# Altium schematic sheet Relay.SchDoc
size A4; Organization: Altium Limited; Address1: L3, 12a Rodborough Rd; Address2: Frenchs Forest; Address3: NSW; Address4: Australia 2086
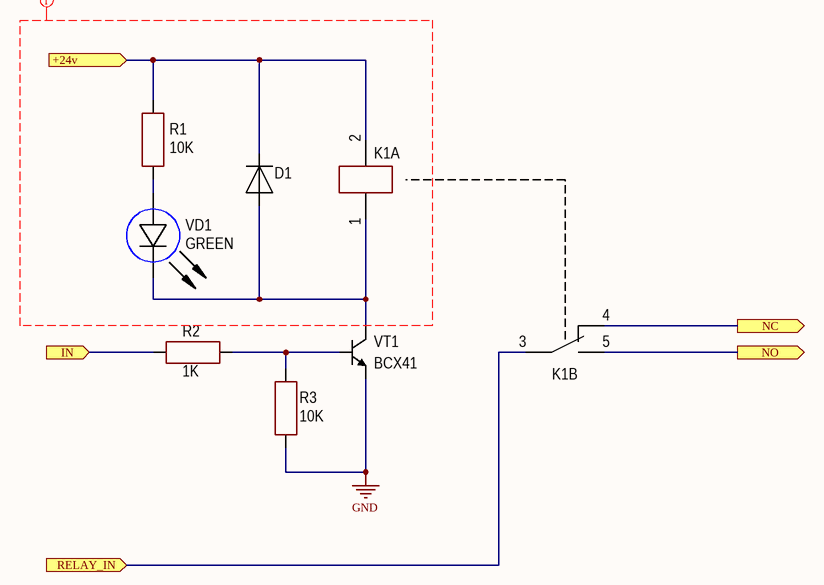
[diagram p0: Relay.SchDoc]

## Parts
D1  (no value)  [DIODE: SMA]
K1  (no value)  [REL: TRJ]  (parts A,B of 2)
R1  value 10K  [RES: 1206]
R2  value 1K  [RES: 1206]
R3  value 10K  [RES: 1206]
VD1  Color: GREEN  [LED: 1206G]
VT1  PartNumber: BCX41  [SOT23]

## Ports
+24v (in), IN (in), NC (out), NO (out), RELAY_IN (in)

## Nets
GND: R3.2 VT1.2(E)
+24v: D1.2 K1.2 R1.1 ; port +24v
IN: R2.1 ; port IN
NC: K1.4 ; port NC
NO: K1.5 ; port NO
RELAY_IN: K1.3 ; port RELAY_IN
NetD1_1: D1.1 K1.1 VD1.2(C) VT1.3(C)
NetR1_2: R1.2 VD1.1(A)
NetR2_2: R2.2 R3.1 VT1.1(B)

## Layout directives
net class Hi_Voltage: (no net found under the mark)

## Notes on the sheet
- Title
- Size:
- Date:
- A4
- Number:
- Time:
- Revision:
- Sheet
- of
- File:

## Library data of the parts
D1 = Diode_single: Manufacturer: Micro Commercial; ValueManufacturerPartNumber: RS1M, SMA; PartNumber: RS1M; TypeDiode: Single diode; Voltage: 1000V; Current: 1A; VoltageDrop: 1V; RecoveryTime: 4ns; Package: SMA; HelpURL: https://www.digikey.com/product-detail/en/micro-commercial-co/1N4148WX-TP/1N4148WXTPMSCT-ND/717312; Temperature: -55...+150°C
K1 = Relay_NT73: Manufacturer: Ningbo Songle; ValueManufacturerPartNumber: Electromechanics relay, 3VDC, 250VAC, 10A, 1NO, -40...+85°C; PartNumber: TRJ-24VDC-SA-CD-R; TypeRelay: Electromechanics relay; VoltageMax: 250VAC; VoltageControlCoil: 3VDC; MaxCurrent: 10A; Package: 1NO; HelpURL: https://lcsc.com/product-detail/Relays_SRD-03VDC-SL-C_C24585.html; Temperature: -40...+85°C
R1 R3 = Resistor_1206: Manufacturer: Yageo; PartNumber: RC1206JR-07100RL; ValueManufacturerPartNumber: Resistor film, 10K, ±5%, 1206, 0.25W, -55...+125°C; TypeResistor: Resistor film; Power: 0.25W; Tolerance: ±5%; Package: 1206; HelpURL: https://www.digikey.com/product-detail/en/yageo/RC1206JR-07100RL/311-100ERCT-ND/732153; Temperature: -55...+125°C
R2 = Resistor_1206: Manufacturer: Yageo; PartNumber: RC1206JR-07100RL; ValueManufacturerPartNumber: Resistor film, 1K, ±5%, 1206, 0.25W, -55...+125°C; TypeResistor: Resistor film; Power: 0.25W; Tolerance: ±5%; Package: 1206; HelpURL: https://www.digikey.com/product-detail/en/yageo/RC1206JR-07100RL/311-100ERCT-ND/732153; Temperature: -55...+125°C
VD1 = LED_single: ValueManufacturerPartNumber: LED, Green, *, *, *, -55...+150°C; TypeDiode: LED; Manufacturer: *; Package: *; HelpURL: *; Temperature: -55...+150°C; Current: *; VoltageDrop: *; PartNumber: *; ColorParameter: Green
VT1 = BJT_NPN_132: Manufacturer: ON Semiconductor; ValueManufacturerPartNumber: NPN transistor, 45V, 100mA, 100MHz, 300mW, 0.6V, 420, SOT-23, -55...+125°C; TypeTransistor: NPN transistor; VoltageCE: 45V; CurrentCE: 100mA; VoltageSaturation: 0.6V; Frequency: 100MHz; CurrentGain: 420; MaxPower: 300mW; Package: SOT-23; HelpURL: https://www.digikey.com/product-detail/en/on-semiconductor/BC847CLT1G/BC847CLT1GOSCT-ND/917836; Temperature: -55...+125°C